# Altium project EVO-PCB.PrjPcb (part 3 of 3)
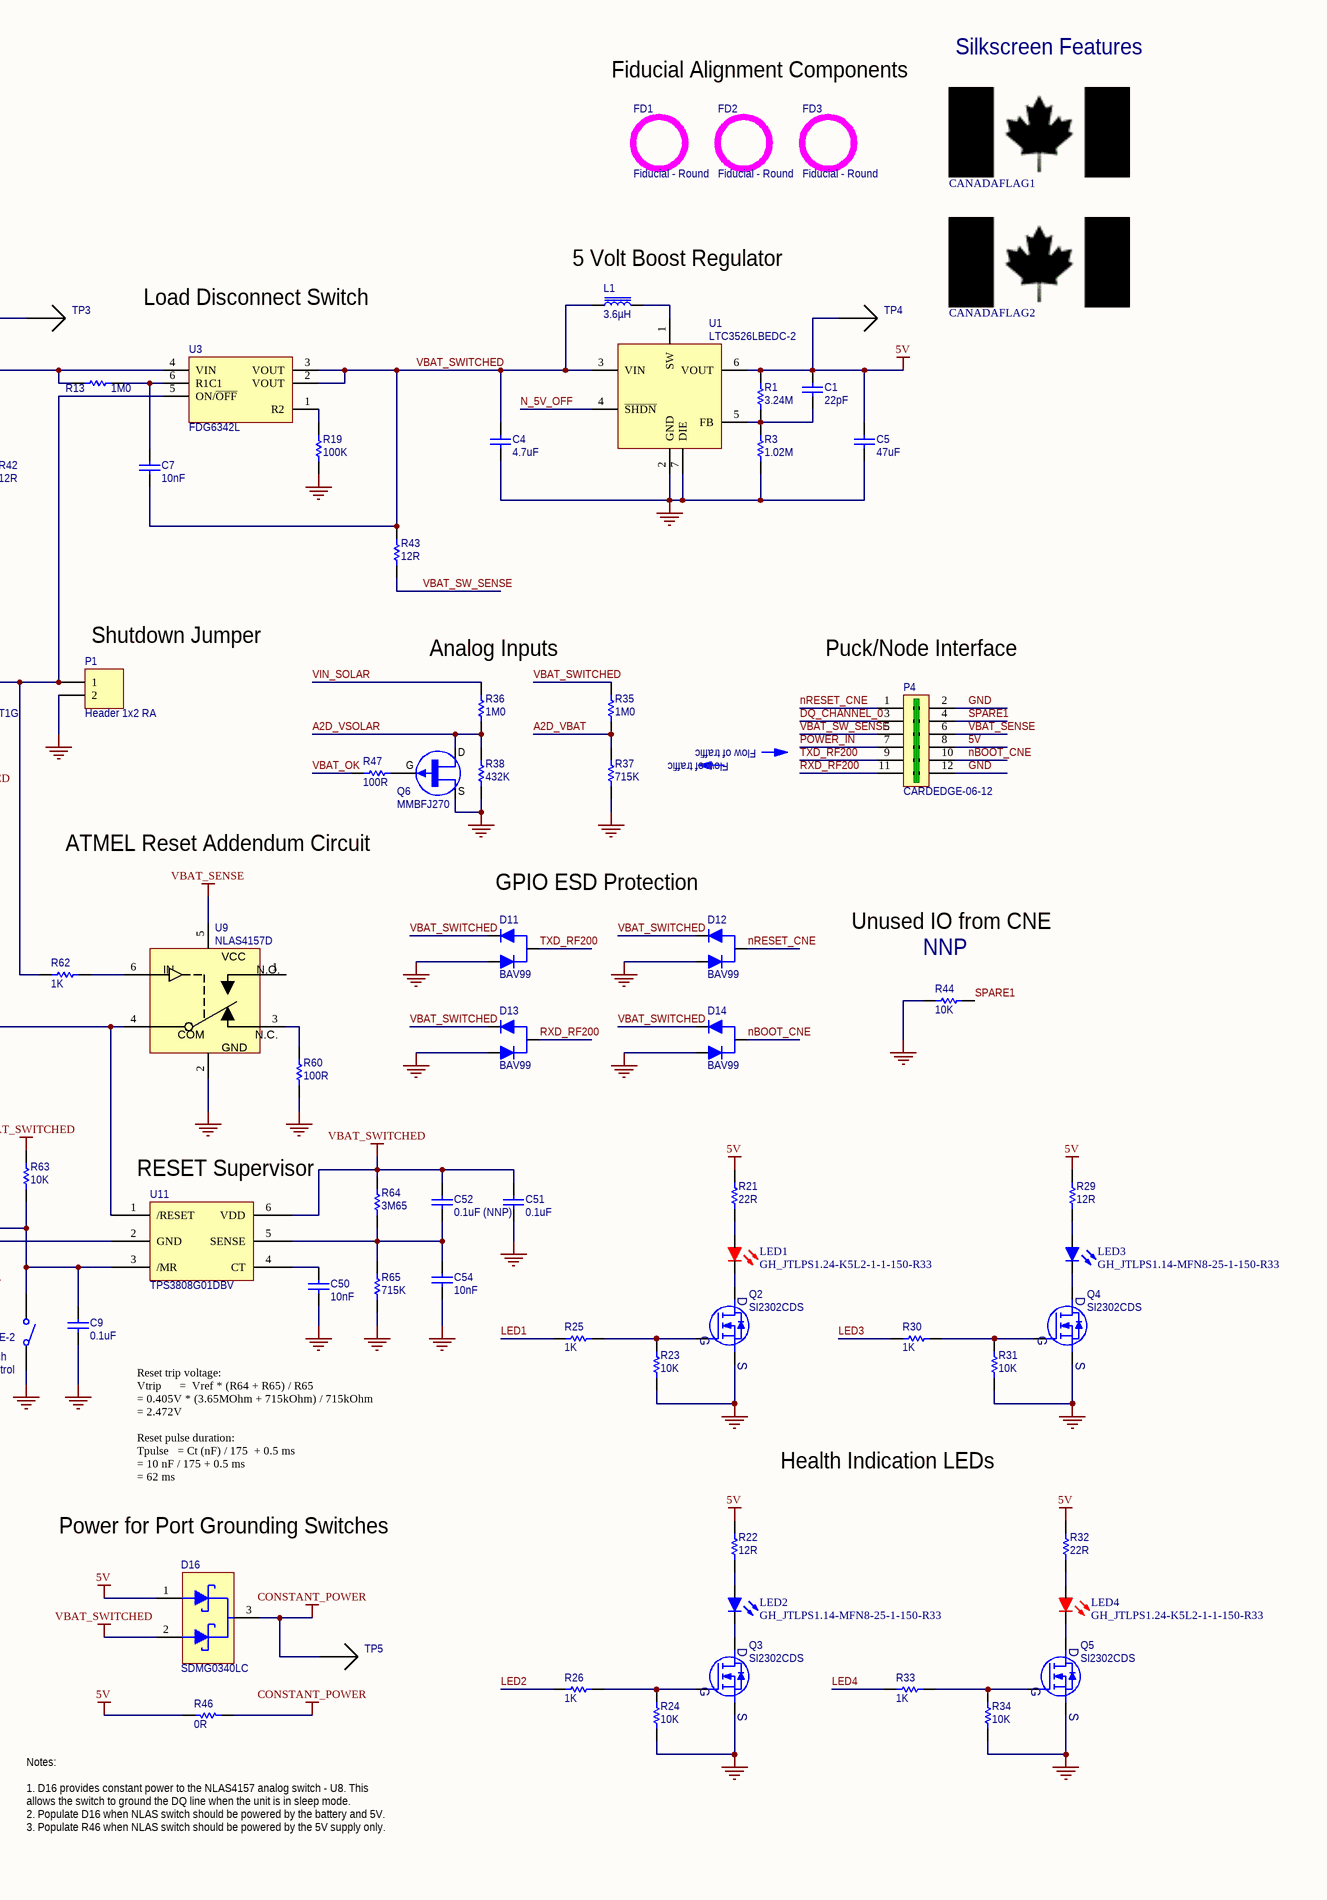
[diagram p3: EVO Schematic.SchDoc, right]

## Sheet EVO Schematic.SchDoc: Cable Node (continued)

### Library data of the parts (continued)
RAD1 = RF 200 Snappy Transceiver: Synapse RF200PF1 Snappy Transceiver; Manufacturer: Synapse Wireless; Antenna Connector: On-Board PCB F Type; Current Receiving: 25 mA; Current Transmitting: 130 mA; Date Interface: PCB Through Hole; Data Rate - Maximum: 2 Mbps; Frequency: 2.4Ghz; Memory Size: 128 KByte FLASH; Modulation or Protocol: SNAP; OPI_VID: 101308; Power - Output: 20dBm; Sensitivity: -107dBm; Voltage - Supply: 2.7 - 3.6 V; Applications: General Purpose; Category: RF/IF and RFID; Component Link Description: http://www.synapse-wireless.com/documents/products/Synapse-RF200PD1-and-RF200PF1-Datasheet.pdf; Component Link URL: http://www.synapse-wireless.com/documents/products/Synapse-RF200PD1-and-RF200PF1-Datasheet.pdf; Manufacturer Part Number: RF200PF1; Operating Temperature: -40 ~ 85 Deg. Cel.; Package / Case: 24 Pin DIP Module; Packaging: Tray; RoHS: RoHS Compliant; Stock: 222; Supplier: DigiKey; Supplier Part Number: 746-1028-ND; Pricing: 1=43.64, 10=40.812, 25=37.7452, 100=35.3862, 250=33.02716, 500=31.3758, 750=30.66807, 1000=30.19626, 2500=29.25262 (CAD)
SP1 = SOLAR_PANEL: Solar Panel, Flexible, 3.6V and 4.8V footprints; Manufacturer: PowerFilm Solar; OPI_VID: 101345; Manufacturer Part Number: MPT3.6-300
SW1 = MK15-E-2: SWITCH REED MAG SMT 25-30 AT; Manufacturer: Standex-Meder Electronics; Circuit: SPST-NO; Must Operate: 25 ~ 30AT; Switching Current (DC) (Max): 500mA; Switching Voltage (DC) (Max): 180V; Switching Power (Max): 10W; Magnet: Not Specified; OPI_VID: 101384; Category 1: Switches; Supplier 1: Digi-Key; Manufacturer Part Number: MK15-E-2; Stock 1: 4362; Pricing 1: 1=1.91, 10=1.674, 25=1.6076, 100=1.4735, 250=1.17212, 500=1.07162, 1000=1.03814 (CAD); Type: Molded Body; Must Release: -; Mounting Type: PCB, Surface Mount; Termination Style: Gull Wing; Packaging: Cut Tape (CT); ComponentLink1URL: http://www.meder.com/fileadmin/products/en_datasheets/9151710025e.pdf; ComponentLink1Description: http://www.meder.com/fileadmin/products/en_datasheets/9151710025e.pdf; Supplier Part Number 1: 374-1303-1-ND; RoHS 1: RoHS Compliant
U1 = LTC3526LBEDC-2: IC REG BOOST SYNC ADJ 0.55A 6DFN; Manufacturer: Linear Technology; Manufacturer Part Number: LTC3526LBEDC-2#TRMPBF; Output Type: Adjustable; Number of Outputs: 1; Voltage - Output: 1.5 V ~ 5.25 V; Voltage - Input: 0.5 V ~ 5.5 V; PWM Type: Current Mode, Burst Mode®; Frequency - Switching: 1MHz; Current - Output: 550mA; Synchronous Rectifier: Yes; OPI_VID: 101346; Supplier 1: Digi-Key; RoHS: RoHS Compliant; Category: Integrated Circuits (ICs); Stock 1: 500; Pricing 1: 500=2.4127 (CAD); Type: Step-Up (Boost); Operating Temperature: -40°C ~ 85°C; Mounting Type: Surface Mount; Package / Case: 6-WFDFN Exposed Pad; Packaging: Tape & Reel (TR); Supplier Device Package: 6-DFN (2x2); ComponentLink1URL: http://cds.linear.com/docs/Datasheet/3526llb2fa.pdf; ComponentLink1Description: http://cds.linear.com/docs/Datasheet/3526llb2fa.pdf; Supplier Part Number 1: LTC3526LBEDC-2#TRMPBFTR-ND
U2 = BQ25504RGTT: IC ENERGY HARV CTRLR BATT 16QFN; Manufacturer: Texas Instruments; Current - Supply: 330nA; Voltage - Supply: 2.5 V ~ 5.25 V; OPI_VID: 101347; Supplier 1: Digi-Key; Manufacturer Part Number: BQ25504RGTT; RoHS: RoHS Compliant; Category: Integrated Circuits (ICs); Stock 1: 500; Pricing 1: 250=4.86028, 500=4.36108, 750=3.94073, 1250=3.67802, 2500=3.49412, 6250=3.36276, 12500=3.25768, 25000=3.15259 (CAD); Applications: Energy Harvesting; Operating Temperature: -40°C ~ 85°C; Mounting Type: Surface Mount; Package / Case: 16-VFQFN Exposed Pad; Supplier Device Package: 16-QFN-EP (3x3); Packaging: Tape & Reel (TR); ComponentLink1URL: http://www.ti.com/lit/ds/symlink/bq25504.pdf; ComponentLink1Description: http://www.ti.com/lit/ds/symlink/bq25504.pdf; Supplier Part Number 1: 296-29741-2-ND
U3 U5 = FDG6342L: IC LOAD SWITCH INTEGRATED SC70-6; Manufacturer: Fairchild Semiconductor; Number of Outputs: 1; Rds (On): 150 mOhm; Internal Switch(s): Yes; Current Limit: 1.5A; Voltage - Input: 2.5 V ~ 8 V; OPI_VID: 101348; Supplier 1: Digi-Key; Manufacturer Part Number: FDG6342L; RoHS: RoHS Compliant; Category: Integrated Circuits (ICs); Stock 1: 24000; Pricing 1: 3000=0.13942, 6000=0.13097, 15000=0.12252, 30000=0.11238, 75000=0.10816, 150000=0.10393 (CAD); Type: High Side Switch; Operating Temperature: -55°C ~ 150°C; Mounting Type: Surface Mount; Package / Case: 6-TSSOP, SC-88, SOT-363; Supplier Device Package: SC-70-6; Packaging: Tape & Reel (TR); ComponentLink1URL: http://www.fairchildsemi.com/ds/FD/FDG6342L.pdf; ComponentLink1Description: http://www.fairchildsemi.com/ds/FD/FDG6342L.pdf; Supplier Part Number 1: FDG6342LTR-ND
U6 = DS2482S-100+: IC BRIDGE I2C TO 1-WIRE 8-SOIC; Manufacturer: Maxim Integrated; Controller Type: I²C Bus Controller; Interface: I²C; Voltage - Supply: 3.3V, 5V; Current - Supply: 750µA; OPI_VID: 101350; Supplier 1: Digi-Key; Manufacturer Part Number: DS2482S-100+; RoHS: RoHS Compliant; Category: Integrated Circuits (ICs); Stock 1: 830; Pricing 1: 1=1.79, 25=1.1904, 100=0.8686, 1000=0.77314 (CAD); Operating Temperature: -40°C ~ 85°C; Mounting Type: Surface Mount; Package / Case: 8-SOIC (0.154", 3.90mm Width); Supplier Device Package: 8-SOIC; Packaging: Tube; ComponentLink1URL: http://datasheets.maxim-ic.com/en/ds/DS2482-100.pdf; ComponentLink1Description: http://datasheets.maxim-ic.com/en/ds/DS2482-100.pdf; Supplier Part Number 1: DS2482S-100+-ND
U8 U9 = NLAS4157DFT2G: IC SWITCH SPDT SC88; Manufacturer: ON Semiconductor; Circuit: 1 x SPDT; On-State Resistance: 1.15 Ohm; Voltage Supply Source: Single Supply; Voltage - Supply, Single/Dual (±): 1.65 V ~ 5.5 V; Current - Supply: 500nA; OPI_VID: 101351; Supplier 1: Digi-Key; Manufacturer Part Number: NLAS4157DFT2G; RoHS: RoHS Compliant; Category: Integrated Circuits (ICs); Stock 1: 3000; Pricing 1: 3000=0.15291, 6000=0.14305, 15000=0.13318, 30000=0.12628, 75000=0.12332, 150000=0.11838 (CAD); Function: Switch; Operating Temperature: -40°C ~ 85°C; Mounting Type: Surface Mount; Package / Case: 6-TSSOP, SC-88, SOT-363; Supplier Device Package: SC-88; Packaging: Tape & Reel (TR); ComponentLink1URL: http://www.onsemi.com/pub_link/Collateral/NLAS4157-D.PDF; ComponentLink1Description: http://www.onsemi.com/pub_link/Collateral/NLAS4157-D.PDF; Supplier Part Number 1: NLAS4157DFT2GOSTR-ND
U10 = PCA9306DP: IC LEVEL TRANSLATOR - TSSOP8; Manufacturer: ON Semiconductor; Manufacturer Part Number: PCA9306DTR2G; OPI_VID: 101536; Description 1: IC VOLT LEVEL TRANSLATOR 8-TSSOP; Category 1: Integrated Circuits (ICs); Logic Function: Translator, Bidirectional, Open Drain; Number of Bits: 2; Input Type: Voltage; Number of Outputs/Channel: 1; Differential - Input:Output: No/No; Propagation Delay (Max): 0.6ns; Voltage - Supply: 1 V ~ 3.6 V, 1.8 V ~ 5.5 V; Supplier 1: Digi-Key; Supplier Part Number 1: PCA9306DTR2GOSCT-ND; RoHS 1: RoHS Compliant; Stock 1: 2822; Pricing 1: 1=0.85, 10=0.743, 25=0.6568, 100=0.5721, 250=0.498, 500=0.42392, 1000=0.33955 (CAD); Packaging: Cut Tape (CT); Output Type: Voltage; Data Rate: -; Number of Channels: 2; Operating Temperature: -55°C ~ 125°C; Package / Case: 8-TSSOP (0.173", 4.40mm Width); Supplier Device Package: 8-TSSOP; Mounting Type: Surface Mount; ComponentLink1URL: http://www.onsemi.com/pub_link/Collateral/PCA9306-D.PDF; ComponentLink1Description: http://www.onsemi.com/pub_link/Collateral/PCA9306-D.PDF
U11 = TPS3808G01DBV: Low Quiescent Current, Programmable-Delay  Supervisory Circuit; Manufacturer: Texas Instruments; Manufacturer Part Number: TPS3808G01DBVR; OPI_VID: 101537; Description 1: IC VOLT SUPERVISOR ADJ SOT23-6; Category 1: Integrated Circuits (ICs); Number of Voltages Monitored: 1; Output: Open Drain or Open Collector; Reset: Active Low; Reset Timeout: Adjustable/Selectable; Supplier 1: Digi-Key; Supplier Part Number 1: 296-17188-1-ND; RoHS 1: RoHS Compliant; Stock 1: 20585; Pricing 1: 1=2.33, 10=2.103, 25=1.8836, 100=1.6938, 250=1.50396, 500=1.31416, 750=1.19004, 1000=0.91261 (CAD); Packaging: Cut Tape (CT); Type: Simple Reset/Power-On Reset; Voltage - Threshold: Adjustable/Selectable; Operating Temperature: -40°C ~ 125°C; Mounting Type: Surface Mount; Package / Case: SOT-23-6; Supplier Device Package: SOT-23-6; ComponentLink1URL: http://www.ti.com/lit/ds/symlink/tps3808g01.pdf; ComponentLink1Description: http://www.ti.com/lit/ds/symlink/tps3808g01.pdf